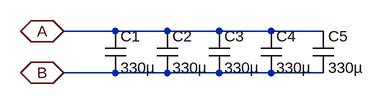
[diagram p0: schematic Bulk_cap.asc]
Bulk_cap.asc, the LTspice schematic file:
Version 4.1
SHEET 1 880 680
WIRE 144 128 64 128
WIRE 224 128 144 128
WIRE 304 128 224 128
WIRE 384 128 304 128
WIRE 464 128 384 128
WIRE 144 192 64 192
WIRE 224 192 144 192
WIRE 304 192 224 192
WIRE 384 192 304 192
WIRE 464 192 384 192
FLAG 64 128 A
IOPIN 64 128 BiDir
FLAG 64 192 B
IOPIN 64 192 BiDir
SYMBOL cap 128 128 R0
SYMATTR InstName C1
SYMATTR Value 330µ
SYMATTR SpiceLine V=450 Rser=0.3m Lser=25n Rpar=1Meg
SYMBOL cap 208 128 R0
SYMATTR InstName C2
SYMATTR Value 330µ
SYMATTR SpiceLine V=450 Rser=0.3m Lser=25n Rpar=1Meg
SYMBOL cap 288 128 R0
SYMATTR InstName C3
SYMATTR Value 330µ
SYMATTR SpiceLine V=450 Rser=0.3m Lser=25n Rpar=1Meg
SYMBOL cap 368 128 R0
SYMATTR InstName C4
SYMATTR Value 330µ
SYMATTR SpiceLine V=450 Rser=0.3m Lser=25n Rpar=1Meg
SYMBOL cap 448 128 R0
SYMATTR InstName C5
SYMATTR Value 330µ
SYMATTR SpiceLine V=450 Rser=0.3m Lser=25n Rpar=1Meg

The netlist it stands for:
* Bulk_cap.asc
C1 A B 330µ V=450 Rser=0.3m Lser=25n Rpar=1Meg
C2 A B 330µ V=450 Rser=0.3m Lser=25n Rpar=1Meg
C3 A B 330µ V=450 Rser=0.3m Lser=25n Rpar=1Meg
C4 A B 330µ V=450 Rser=0.3m Lser=25n Rpar=1Meg
C5 A B 330µ V=450 Rser=0.3m Lser=25n Rpar=1Meg
.backanno
.end